# Altium schematic sheet ideal_diode_ch0.SchDoc: Ideal Diode CH0
size A4; Date: 2015-02-27; Author: Piotr Kuligowski; Revision: 1-0; SheetTotal: 14; Model: EM1
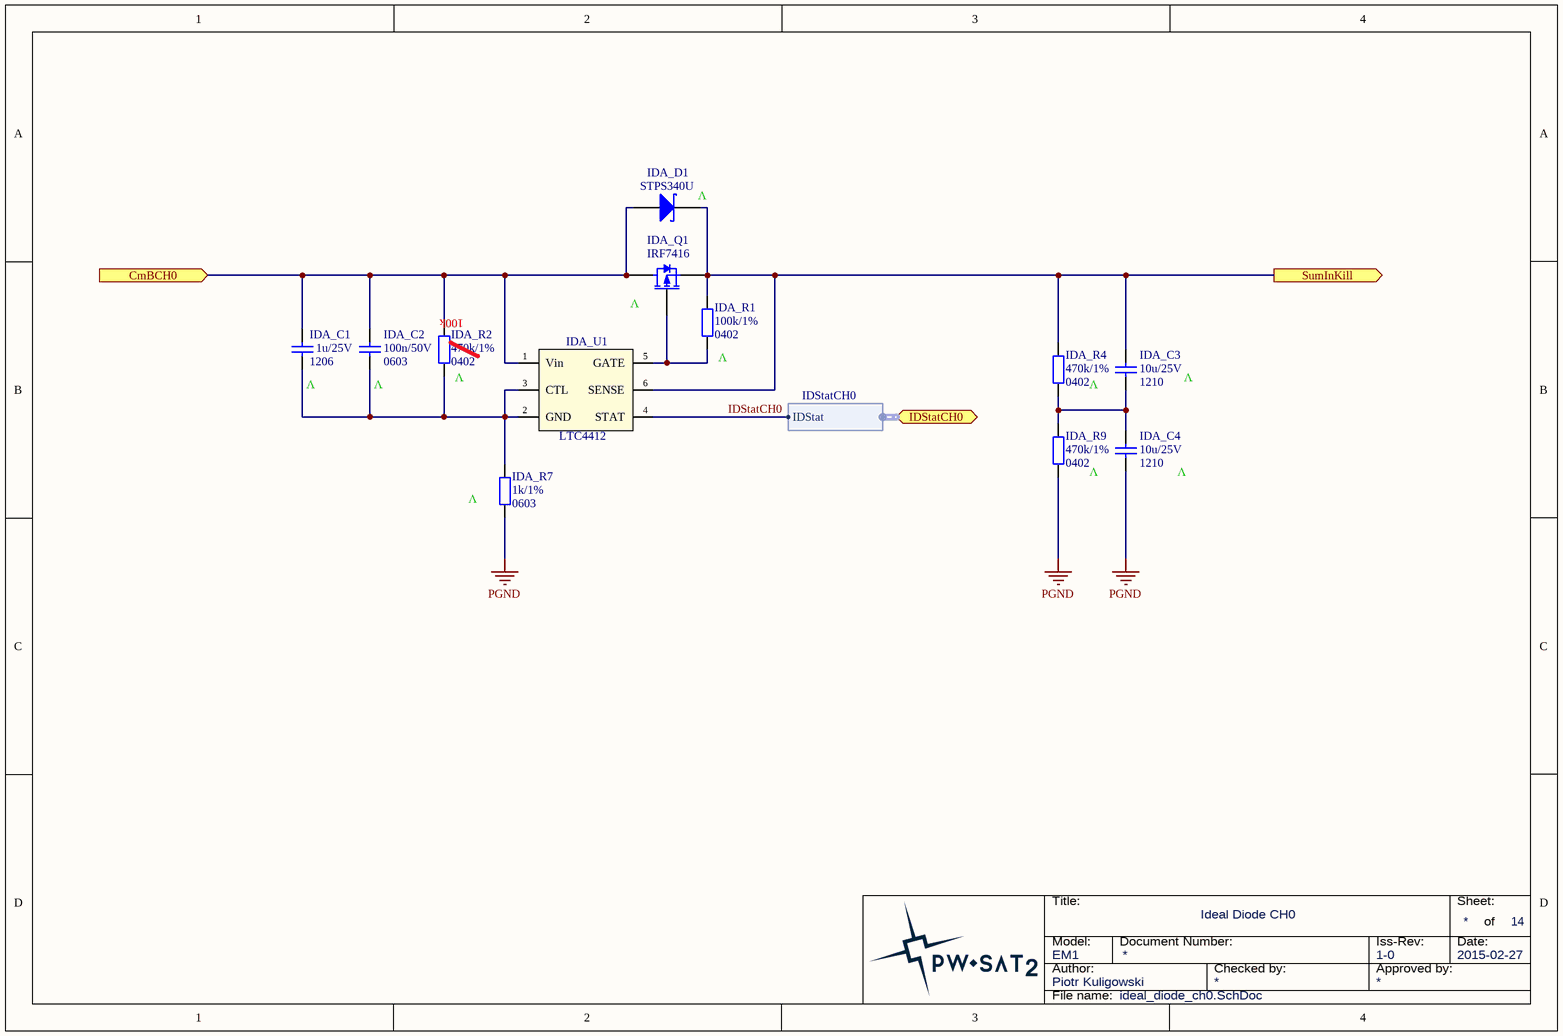
[diagram p0: ideal_diode_ch0.SchDoc]

## Parts
IDA_C1  Package: 1206  [SMD_Capacitor_1206]  (hidden comment: 1u/25V)
IDA_C2  Package: 0603  [SMD_Capacitor_0603]  (hidden comment: 100n/50V)
IDA_C3  Package: 1210  [SMD_Capacitor_1210]  (hidden comment: 10u/25V)
IDA_C4  Package: 1210  [SMD_Capacitor_1210]  (hidden comment: 10u/25V)
IDA_D1  STPS340U  [DO-214AA]
IDA_Q1  IRF7416  [SOIC-8-N_SSSGDDDD]
IDA_R1  Package: 0402  [SMD_Resistor_0402]  (hidden comment: 100k/1%)
IDA_R2  Package: 0402  [SMD_Resistor_0402]  (hidden comment: 470k/1%)
IDA_R4  Package: 0402  [SMD_Resistor_0402]  (hidden comment: 470k/1%)
IDA_R7  Package: 0603  [SMD_Resistor_0603]  (hidden comment: 1k/1%)
IDA_R9  Package: 0402  [SMD_Resistor_0402]  (hidden comment: 470k/1%)
IDA_U1  LTC4412  [SOT23-6]

## Ports
CmBCH0 (in), IDStatCH0 (harness IDStatCH0), SumInKill (out)

## Harnesses
IDStatCH0: IDStat

## Nets
PGND: IDA_C4.2 IDA_R7.2 IDA_R9.2
CmBCH0: IDA_C1.1 IDA_C2.1 IDA_D1.A IDA_Q1.D IDA_R2.1 IDA_U1.1(Vin) ; port CmBCH0
IDStatCH0: IDA_U1.4(STAT) ; port IDStatCH0.IDStat
SumInKill: IDA_C3.1 IDA_D1.K IDA_Q1.S IDA_R1.1 IDA_R4.1 IDA_U1.6(SENSE) ; port SumInKill
NetIDA_C1_2: IDA_C1.2 IDA_C2.2 IDA_R2.2 IDA_R7.1 IDA_U1.2(GND) IDA_U1.3(CTL)
NetIDA_C3_2: IDA_C3.2 IDA_C4.1 IDA_R4.2 IDA_R9.1
NetIDA_Q1_G: IDA_Q1.G IDA_R1.2 IDA_U1.5(GATE)

## Notes on the sheet
- (near IDA_D1) V
- (near IDA_R2) 100k
- (near IDA_Q1) V
- (near IDA_C1) V
- (near IDA_C2) V
- (near IDA_R2) V
- (near IDA_R1) V
- (near IDA_C3) V
- V
- (near IDA_R7) V
- (near IDA_C4) V
- Title:
- Sheet:
- of
- Author:
- Model:
- Document Number:
- Checked by:
- Iss-Rev:
- Approved by:
- Date:
- File name:

## Library data of the parts
IDA_C1 = Cer_C1206T105K3RALTU: Ceramic Cap Kemet COTS 1u/25V X7R 1206; ManufacturerPartNumber: C1206T105K3RALTU; Manufacturer: Kemet; Value: 1u/25V
IDA_C2 = Cer_GCJ188R71H104KA12D: Ceramic Cap Murata Automotive 100n/50V X7R 0603; Manufacturer: Murata; ManufacturerPartNumber: GCJ188R71H104KA12D; Value: 100n/50V
IDA_C3 IDA_C4 = Cer_GCJ32ER71E106KA12L: Ceramic Cap Murata Automotive 10u/25V X7R 1210; Manufacturer: Murata; ManufacturerPartNumber: GCJ32ER71E106KA12L; Value: 10u/25V
IDA_D1 = STPS340x: 3A/40V Power Schottky Rectifier.; Manufacturer: STMicroelectronics; Value: STPS340U
IDA_Q1 = IRF7416: 10A/30V HEXFET Power P-MOSFET.; Manufacturer: International Rectifier; Value: IRF7416
IDA_R1 = CRCW0402100KFKxxxx: 100k/1% Vishay CRCW 0402 Resistor. 63mW, 100ppm, 50V.; Manufacturer: Vishay; Value: 100k/1%
IDA_R2 IDA_R4 IDA_R9 = CRCW0402470KFKxxxx: 470k/1% Vishay CRCW 0402 Resistor. 63mW, 100ppm, 50V.; Manufacturer: Vishay; ManufacturerPartNumber: CRCW0402470KFKxxxx; Value: 470k/1%
IDA_R7 = CRCW06031K00FKxxxx: 1k/1% Vishay CRCW 0603 Resistor. 100mW, 100ppm, 75V.; Manufacturer: Vishay; ManufacturerPartNumber: CRCW06031K00FKxxxx; Value: 1k/1%
IDA_U1 = LTC4412: Ideal Diode, Low Loss PowerPath Controller.; Manufacturer: Linear Technology; Value: LTC4412